# Altium schematic sheet 14audio.SchDoc
size B
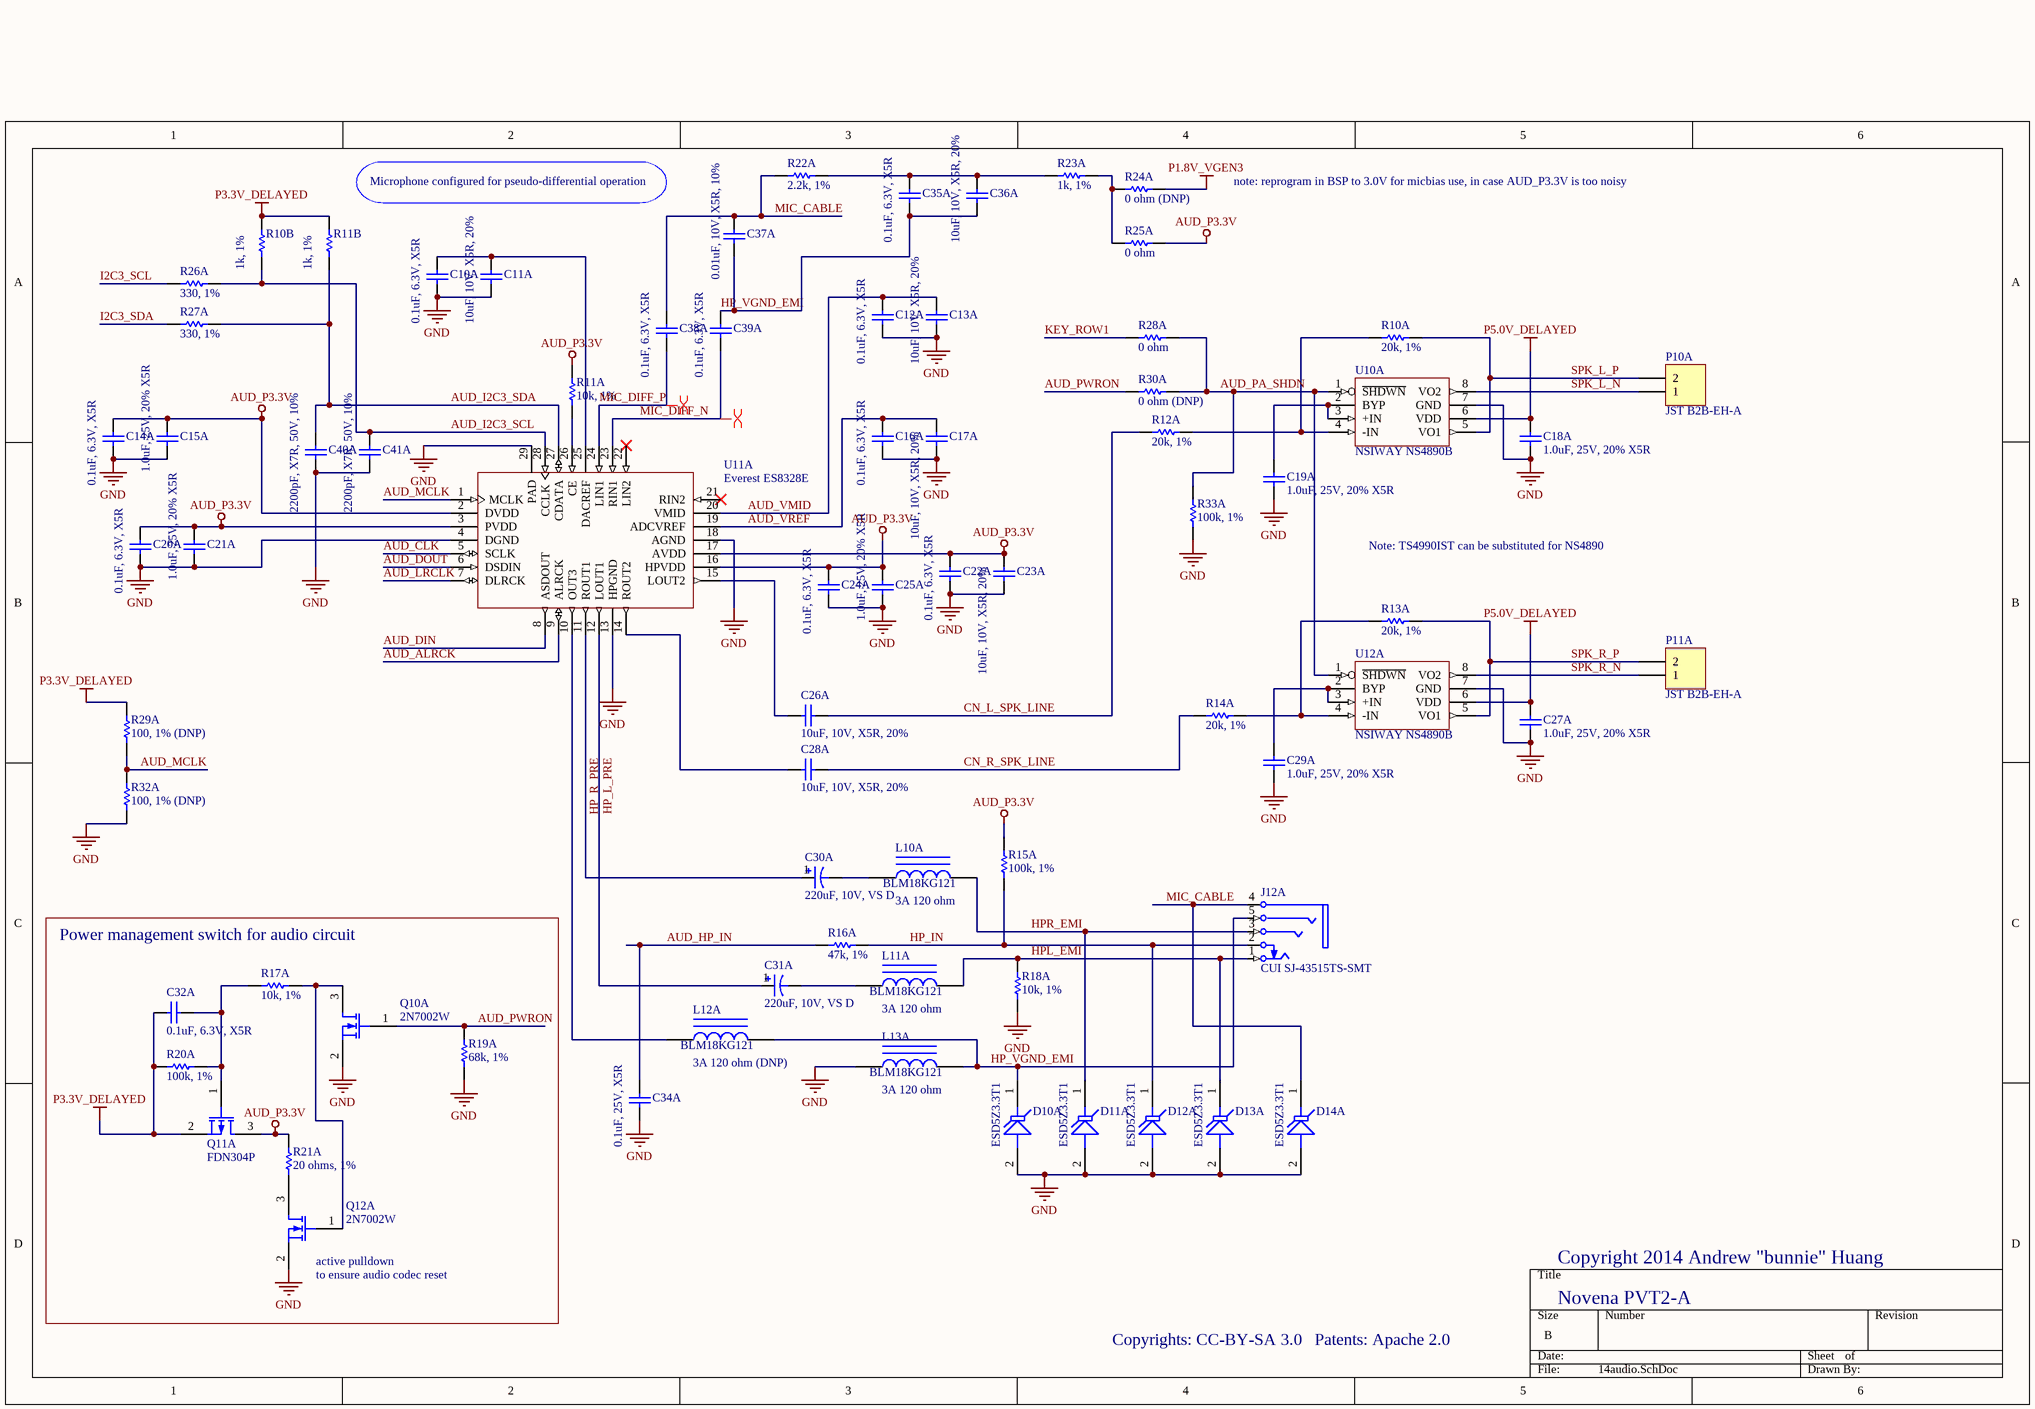
[diagram p0: 14audio.SchDoc]

## Parts
C10A  0.1uF, 6.3V, X5R  [CAPC0603N_B]
C11A  10uF, 10V, X5R, 20%  [CAPC1608N]
C12A  0.1uF, 6.3V, X5R  [CAPC0603N_B]
C13A  10uF, 10V, X5R, 20%  [CAPC1608N]
C14A  0.1uF, 6.3V, X5R  [CAPC0603N_B]
C15A  1.0uF, 25V, 20% X5R  [CAPC1608N]
C16A  0.1uF, 6.3V, X5R  [CAPC0603N_B]
C17A  10uF, 10V, X5R, 20%  [CAPC1608N]
C18A  1.0uF, 25V, 20% X5R  [CAPC1608N]
C19A  1.0uF, 25V, 20% X5R  [CAPC1608N]
C20A  0.1uF, 6.3V, X5R  [CAPC0603N_B]
C21A  1.0uF, 25V, 20% X5R  [CAPC1608N]
C22A  0.1uF, 6.3V, X5R  [CAPC0603N_B]
C23A  10uF, 10V, X5R, 20%  [CAPC1608N]
C24A  0.1uF, 6.3V, X5R  [CAPC0603N_B]
C25A  1.0uF, 25V, 20% X5R  [CAPC1608N]
C26A  10uF, 10V, X5R, 20%  [CAPC1608N]
C27A  1.0uF, 25V, 20% X5R  [CAPC1608N]
C28A  10uF, 10V, X5R, 20%  [CAPC1608N]
C29A  1.0uF, 25V, 20% X5R  [CAPC1608N]
C30A  220uF, 10V, VS D  [ALCAP_D]
C31A  220uF, 10V, VS D  [ALCAP_D]
C32A  0.1uF, 6.3V, X5R  [CAPC0603N_B]
C34A  0.1uF, 25V, X5R  [CAPC1005N]
C35A  0.1uF, 6.3V, X5R  [CAPC0603N_B]
C36A  10uF, 10V, X5R, 20%  [CAPC1608N]
C37A  0.01uF, 10V, X5R, 10%  [CAPC0603N_B]
C38A  0.1uF, 6.3V, X5R  [CAPC0603N_B]
C39A  0.1uF, 6.3V, X5R  [CAPC0603N_B]
C40A  2200pF, X7R, 50V, 10%  [CAPC1005N]
C41A  2200pF, X7R, 50V, 10%  [CAPC1005N]
D10A  ESD5Z3.3T1  [SOD-523]
D11A  ESD5Z3.3T1  [SOD-523]
D12A  ESD5Z3.3T1  [SOD-523]
D13A  ESD5Z3.3T1  [SOD-523]
D14A  ESD5Z3.3T1  [SOD-523]
J12A  CUI SJ-43515TS-SMT  [CUI_SJ_43515TS-SMT]
L10A  BLM18KG121  value 3A 120 ohm  [INDC1608AN]
L11A  BLM18KG121  value 3A 120 ohm  [INDC1608AN]
L12A  BLM18KG121  value 3A 120 ohm (DNP)  [INDC1608AN]
L13A  BLM18KG121  value 3A 120 ohm  [INDC1608AN]
P10A  JST B2B-EH-A  [JST_B2B_EH_A]
P11A  JST B2B-EH-A  [JST_B2B_EH_A]
Q10A  2N7002W  [SOT323-3AN]
Q11A  FDN304P  [SOT23-3N]
Q12A  2N7002W  [SOT323-3AN]
R10A  20k, 1%  [RESC1005N]
R10B  1k, 1%  [RESC1005N]
R11A  10k, 1%  [RESC1005N]
R11B  1k, 1%  [RESC1005N]
R12A  20k, 1%  [RESC1005N]
R13A  20k, 1%  [RESC1005N]
R14A  20k, 1%  [RESC1005N]
R15A  100k, 1%  [RESC1005N]
R16A  47k, 1%  [RESC1005N]
R17A  10k, 1%  [RESC1005N]
R18A  10k, 1%  [RESC1005N]
R19A  68k, 1%  [RESC1005N]
R20A  100k, 1%  [RESC1005N]
R21A  20 ohms, 1%  [RESC1005N]
R22A  2.2k, 1%  [RESC1005N]
R23A  1k, 1%  [RESC1005N]
R24A  0 ohm (DNP)  [RESC1005N]
R25A  0 ohm  [RESC1005N]
R26A  330, 1%  [RESC1005N]
R27A  330, 1%  [RESC1005N]
R28A  0 ohm  [RESC1005N]
R29A  100, 1% (DNP)  [RESC1005N]
R30A  0 ohm (DNP)  [RESC1005N]
R32A  100, 1% (DNP)  [RESC1005N]
R33A  100k, 1%  [RESC1005N]
U10A  NSIWAY NS4890B  [MSOP8]
U11A  Everest ES8328E  [QFN50P500X500-28V1N]
U12A  NSIWAY NS4890B  [MSOP8]

## Blocks framed on the sheet
Power management switch for audio circuit: C32A Q10A Q11A Q12A R17A R19A R20A R21A

## Nets
AUD_P3.3V: C14A.2 C15A.2 C20A.2 C21A.2 C22A.2 C23A.1 C24A.2 C25A.2 Q11A.3(D) R11A.2 R15A.2 R21A.1 R25A.2 U11A.2(DVDD) U11A.3(PVDD) U11A.16(HPVDD) U11A.17(AVDD)
GND: C10A.1 C11A.2 C12A.1 C13A.2 C14A.1 C15A.1 C16A.1 C17A.2 C18A.1 C19A.1 C20A.1 C21A.1 C22A.1 C23A.2 C24A.1 C25A.1 C27A.1 C29A.1 C34A.1 C40A.1 C41A.1 D10A.2(A) D11A.2(A) D12A.2(A) D13A.2(A) D14A.2(A) L13A.1 Q10A.2(S) Q12A.2(S) R18A.2 R19A.2 R32A.1 R33A.1 U10A.7(GND) U11A.4(DGND) U11A.13(HPGND) U11A.18(AGND) U11A.29(PAD) U12A.7(GND)
P1.8V_VGEN3: R24A.2
P3.3V_DELAYED: C32A.2 Q11A.2(S) R10B.2 R11B.2 R20A.2 R29A.2
P5.0V_DELAYED: C18A.2 C27A.2 U10A.6(VDD) U12A.6(VDD)
AUD_ALRCK: U11A.9(ALRCK)
AUD_CLK: U11A.5(SCLK)
AUD_DIN: U11A.8(ASDOUT)
AUD_DOUT: U11A.6(DSDIN)
AUD_HP_IN: C34A.2 R16A.2
AUD_I2C3_SCL: C41A.2 R10B.1 R26A.1 U11A.28(CCLK)
AUD_I2C3_SDA: C40A.2 R11B.1 R27A.1 U11A.27(CDATA)
AUD_LRCLK: U11A.7(DLRCK)
AUD_MCLK: R29A.1 R32A.2 U11A.1(MCLK)
AUD_PA_SHDN: R28A.2 R30A.2 R33A.2 U10A.1(~{SHDWN}) U12A.1(~{SHDWN})
AUD_PWRON: Q10A.1(G) R19A.1 R30A.1
AUD_VMID: C12A.2 C13A.1 U11A.20(VMID)
AUD_VREF: C16A.2 C17A.1 U11A.19(ADCVREF)
CN_L_SPK_LINE: C26A.2 R12A.2
CN_R_SPK_LINE: C28A.2 R14A.2
HP_IN: D12A.1(K) J12A.2(TN) R15A.1 R16A.1
HP_L_PRE: C31A.1 U11A.12(LOUT1)
HP_R_PRE: C30A.1 U11A.11(ROUT1)
HP_VGND_EMI: C35A.1 C36A.2 C37A.2 C39A.2 D10A.1(K) J12A.5(R) L12A.2 L13A.2
HPL_EMI: D13A.1(K) J12A.1(T) L11A.2 R18A.1
HPR_EMI: D11A.1(K) J12A.3(R) L10A.2
I2C3_SCL: R26A.2
I2C3_SDA: R27A.2
KEY_ROW1: R28A.1
MIC_CABLE: C37A.1 C38A.2 D14A.1(K) J12A.4(S) R22A.1
MIC_DIFF_N: C39A.1 U11A.23(RIN1)
MIC_DIFF_P: C38A.1 U11A.24(LIN1)
SPK_L_N: P10A.1 U10A.8(VO2)
SPK_L_P: P10A.2 R10A.1 U10A.5(VO1)
SPK_R_N: P11A.1 U12A.8(VO2)
SPK_R_P: P11A.2 R13A.1 U12A.5(VO1)
NetC10A_2: C10A.2 C11A.1 U11A.25(DACREF)
NetC19A_2: C19A.2 U10A.2(BYP) U10A.3(+IN)
NetC26A_1: C26A.1 U11A.15(LOUT2)
NetC28A_1: C28A.1 U11A.14(ROUT2)
NetC29A_2: C29A.2 U12A.2(BYP) U12A.3(+IN)
NetC30A_2: C30A.2 L10A.1
NetC31A_2: C31A.2 L11A.1
NetC32A_1: C32A.1 Q11A.1(G) R17A.1 R20A.1
NetC35A_2: C35A.2 C36A.1 R22A.2 R23A.1
NetL12A_1: L12A.1 U11A.10(OUT3)
NetQ10A_3: Q10A.3(D) Q12A.1(G) R17A.2
NetQ12A_3: Q12A.3(D) R21A.2
NetR10A_2: R10A.2 R12A.1 U10A.4(-IN)
NetR11A_1: R11A.1 U11A.26(CE)
NetR13A_2: R13A.2 R14A.1 U12A.4(-IN)
NetR23A_2: R23A.2 R24A.1 R25A.1

Not connected (* = marked no-connect by the designer): U11A 21(RIN2)* 22(LIN2)*

## Layout directives
differential pair: MIC_DIFF_N, MIC_DIFF_P

## Notes on the sheet
- Microphone configured for pseudo-differential operation
- note: reprogram in BSP to 3.0V for micbias use, in case AUD_P3.3V is too noisy
- Note: TS4990IST can be substituted for NS4890
- (near Q12A) active pulldown
- (near Q12A) to ensure audio codec reset
- Copyright 2014 Andrew "bunnie" Huang
- Copyrights: CC-BY-SA 3.0
- Patents: Apache 2.0
- Novena PVT2-A

## Library data of the parts
C10A C11A C12A C13A C14A C15A C16A C17A C18A C19A C20A C21A C22A C23A C24A C25A C26A C27A C28A C29A C32A C34A C35A C36A C37A C38A C39A C40A C41A = Cap Semi: Capacitor (Semiconductor SIM Model); Published: 8-Jun-2000; LatestRevisionDate: 17-Jul-2002; LatestRevisionNote: Re-released for DXP Platform.; PackageReference: C1206; Publisher: Altium Limited
C30A C31A = Cap Pol3: Polarized Capacitor (Surface Mount); Published: 8-Jun-2000; LatestRevisionDate: 17-Jul-2002; LatestRevisionNote: Re-released for DXP Platform.; PackageReference: C0805; Publisher: Altium Limited
D10A D11A D12A D13A D14A = Tranzorb: On Semi 3.3V standoff TVS diode; Published: 24-Mar-1999; LatestRevisionDate: 17-Jul-2002; LatestRevisionNote: Re-released for DXP Platform.; PackageReference: DO-7; Publisher: Altium Limited
J12A = Phonejack4 TN: Jack Socket, 3.5mm, SMT, 4-conductor; PackageDocument: 2003; PCB_Layout: Complies with manufacturer's recommendation.; DrillAndSlotSize: Corresponds to nominal value.; Published: 15-Jul-2004; DatasheetDocument: 2003; PackageReference: S1VS_SSB; Publisher: Altium Limited; ComponentLink1Description: Manufacturer Link; ComponentLink1URL: http://www.cliffuk.co.uk/
L10A L11A L12A L13A = Inductor Iron: Magnetic-Core Inductor; Published: 24-Mar-1999; LatestRevisionDate: 17-Jul-2002; LatestRevisionNote: Re-released for DXP Platform.; PackageReference: AXIAL-0.9; Publisher: Altium Limited
P10A P11A = Header 2: Header, 2-Pin; LatestRevisionDate: 17-Jul-2002; LatestRevisionNote: Re-released for DXP Platform.; Publisher: Altium Limited
Q10A Q12A = MOSFET-N: N-Channel MOSFET; Published: 8-Jun-2000; LatestRevisionDate: 17-Jul-2002; LatestRevisionNote: Re-released for DXP Platform.; PackageVersion: 1995/1996; PackageReference: E3; Publisher: Altium Limited
Q11A = MOSFET-P: P-Channel MOSFET; Published: 8-Jun-2000; LatestRevisionDate: 17-Jul-2002; LatestRevisionNote: Re-released for DXP Platform.; PackageVersion: 1995/1996; PackageReference: E3; Publisher: Altium Limited; PackageDescription: TO, Flat Index; 3 In-Line, Axial Leads; Body Dia. 4.6mm; Lead Dia. 0.5 mm (max)
R10A R10B R11A R11B R12A R13A R14A R16A R17A R18A R19A R21A R22A R23A R24A R25A R26A R27A R28A R29A R30A R32A = Res1: Resistor; Value: 100k; Published: 8-Jun-2000; LatestRevisionDate: 17-Jul-2002; LatestRevisionNote: Re-released for DXP Platform.; PackageReference: AXIAL-0.3; Publisher: Altium Limited
R15A R20A R33A = Res1: Resistor; Published: 8-Jun-2000; LatestRevisionDate: 17-Jul-2002; LatestRevisionNote: Re-released for DXP Platform.; PackageReference: AXIAL-0.3; Publisher: Altium Limited; Value: 100k
U10A U12A = NSIWAY_NS4890: 1W 8 ohm low-cost amplifier
U11A = Everest_ES8328: Low-cost audio CODEC by Everest